# EAGLE design untitled (EAGLE 9.6.2)
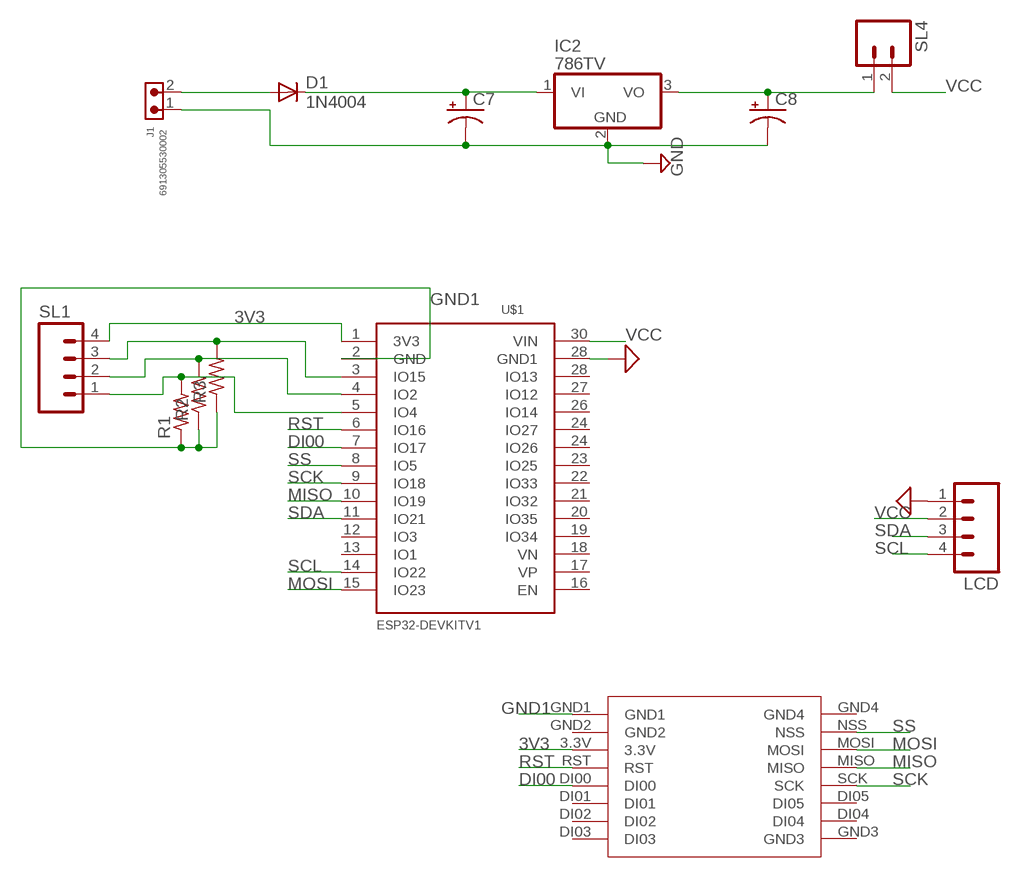
[diagram p0: schematic, sheet 1]

## Parts
C7  CAPACITOR-PE5-10.5  [E5-10,5]
C8  CAPACITOR-PE5-6  [E5-6]
D1  1N4004  [DO41-10]
IC2  786TV  [TO220V]
J1  691305530002  691305530002  [691305530002]
LCD  M04  [04P]
R1  R-US_0207/10  [0207/10]
R2  R-US_0207/10  [0207/10]
R3  R-US_0207/7  [0207/7]
SL1  M04  [04P]
SL4  M02  [02P]
U$1  ESP32DEVKITV1  [ESP32-DEVKITV1]
U$2  LORASX1278  [LORASX1278]

## Nets
3V3: SL1.4 U$1.1(3V3) U$2.3.3V
DI00: U$1.7(IO17) U$2.DI00
GND: C7.- C8.- IC2.2(GND) J1.1 LCD.1 U$1.28(GND1) ; supply symbol labelled SUP
GND1: R1.1 R2.1 R3.1 U$1.2(GND) U$2.GND1
MISO: U$1.10(IO19) U$2.MISO
MOSI: U$1.15(IO23) U$2.MOSI
N$1: D1.A J1.2
N$2: C8.+ IC2.3(VO) SL4.1
N$4: R1.2 SL1.1 U$1.5(IO4)
N$5: R2.2 SL1.2 U$1.4(IO2)
N$6: R3.2 SL1.3 U$1.3(IO15)
RST: U$1.6(IO16) U$2.RST
SCK: U$1.9(IO18) U$2.SCK
SCL: LCD.4 U$1.14(IO22)
SDA: LCD.3 U$1.11(IO21)
SS: U$1.8(IO5) U$2.NSS
VCC: LCD.2 SL4.2 U$1.30(VIN)
VIN: C7.+ D1.C IC2.1(VI)
Unconnected: U$1.12(IO3) U$1.13(IO1) U$1.16(EN) U$1.17(VP) U$1.18(VN) U$1.19(IO34) U$1.20(IO35) U$1.21(IO32) U$1.22(IO33) U$1.23(IO25) U$1.24(IO26) U$1.24(IO27) U$1.26(IO14) U$1.27(IO12) U$1.28(IO13) U$2.DI01 U$2.DI02 U$2.DI03 U$2.DI04 U$2.DI05 U$2.GND2 U$2.GND3 U$2.GND4

## Library data of the parts
C7 C8 = BeagleBone_Blue_R3:CAPACITOR-P: POLARIZED CAPACITOR, American symbol
D1 = adafruit:1N4004: DIODE General purpose 1N400x type rectifier (With bigger pads) http://www.ladyada.net/library/pcb/eaglelibrary.html
IC2 = linear:78*: Positive VOLTAGE REGULATOR Source: http://cache.national.com/ds/LM/LM78L05.pdf http://www.fairchildsemi.com/ds/LM/LM7805.pdf
J1 = Wurth_Connectors_WR-TBL Pluggable Connector:691305530002: WR-TBL Serie 3055 - 5,08 mm - PCB Header Vertical Entry with Plastic Latches KIND PROPERTIES Pitch 5.08 mm MATERIAL PROPERTIES Insulator Material PA66 Insulator Flammability Rating UL94 V-0 Insulator Color Green Terminal Material Copper Alloy Terminal Plating Tin-plated surface GENERAL INFORMATION Operating Temperature -40 up to +105 °C ELECTRICAL PROPERTIES IR UL 16 A Working Voltage [UL] 300 V (AC) Withstanding Voltage [UL] 2500 V (AC) Contact Resistance [UL] 20 mΩ CERTIFICATION UL Approval E315414 <https://www.we-online.com/catalog/media/o135349v209%20Family_WR-TBL3_6913055300xx.jpg> Details see: https://www.we-online.com/catalog/en/TBL_5_08_3055_6913055300XX/ Updated by Ella Wu 2019-12-30 2019(C) Wurth Elektronik; DATASHEET-URL: https://www.we-online.com/catalog/datasheet/691305530002.pdf; IR-UL: 16A; MOUNT: THT; PART-NUMBER: 691305530002; PINS: 2; PITCH: 5.08mm; TYPE: Vertical; WORKING-VOLTAGE-UL: 300V (AC)
LCD SL1 = con-amp-quick:M04: AMP QUICK CONNECTOR; OC_FARNELL: unknown; OC_NEWARK: unknown
R1-R3 = adafruit:R-US_: RESISTOR, American symbol
SL4 = con-amp-quick:M02: AMP QUICK CONNECTOR; OC_FARNELL: unknown; OC_NEWARK: unknown
U$1 = ESP32-DEVKITV1:ESP32DEVKITV1
U$2 = sx1278:LORASX1278

## Board
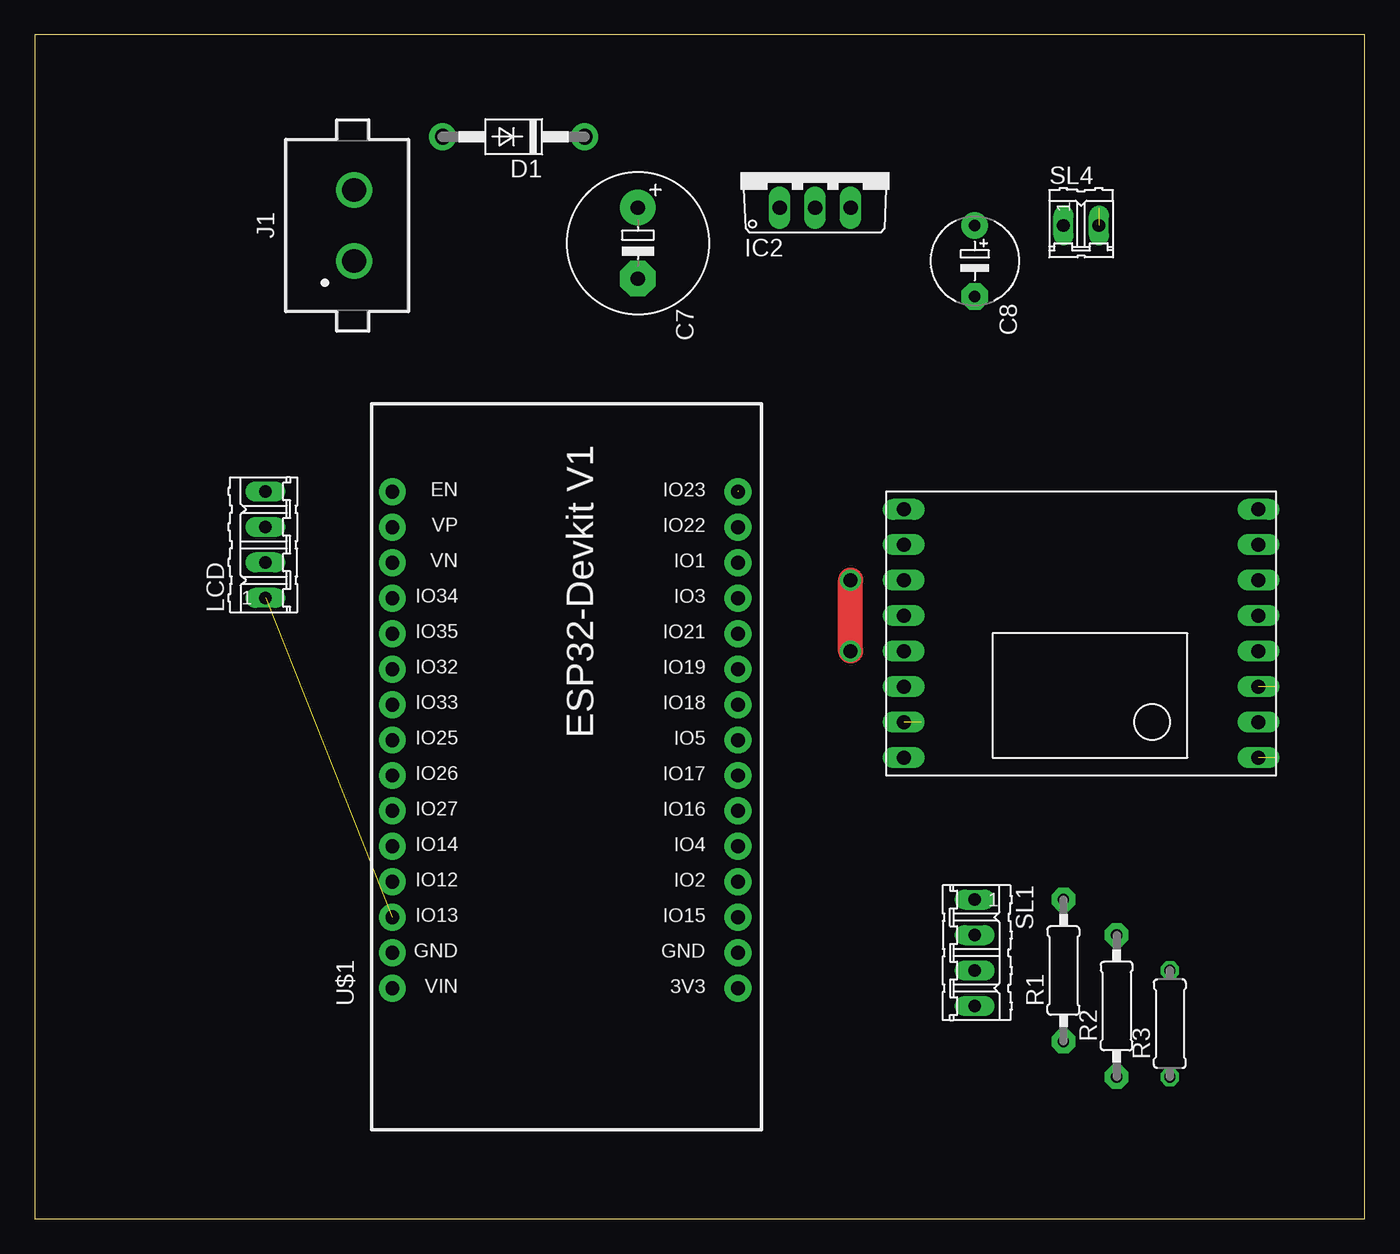
[diagram p1: board, top side]
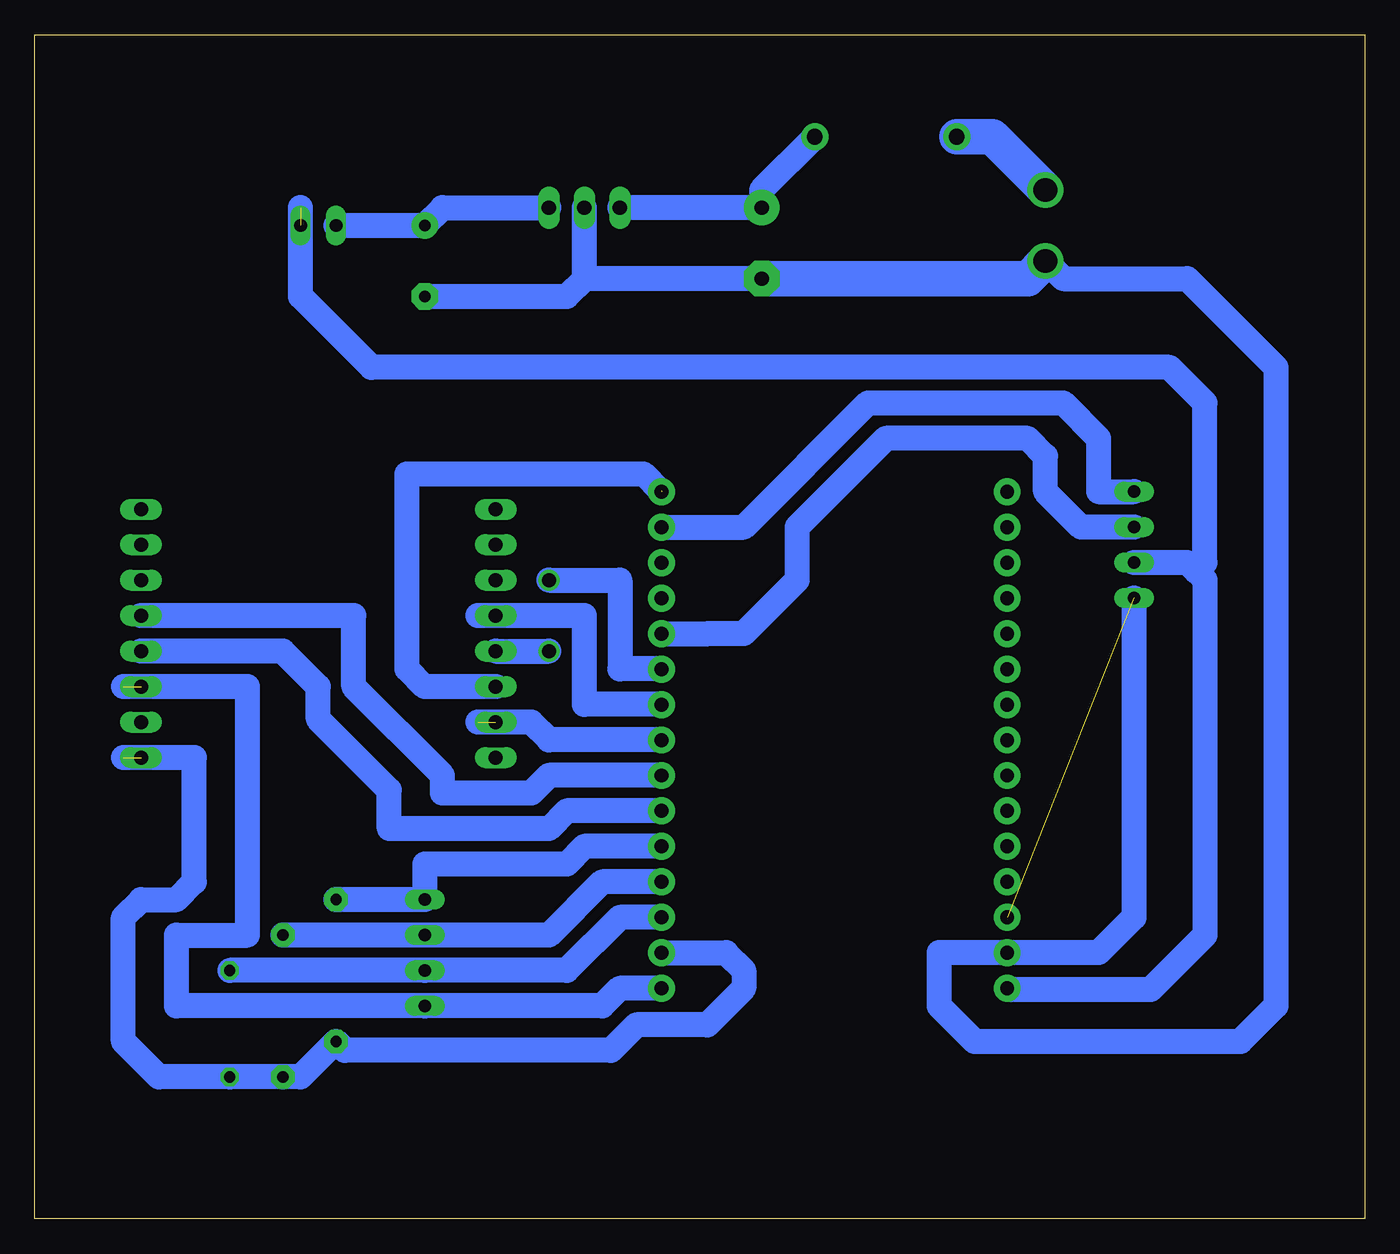
[diagram p2: board, bottom side, seen from below]

Size 95.23 x 84.76 mm. Coordinates in mm from the lower left corner, seen from the top.
Outline: 0,0 95.23,0 95.23,84.76 0,84.76 0,0
Copper layers (1*16): Top 0.035mm / dielectric 1.5mm / Bottom 0.035mm
Design rules "default *": minimum track width 6mil, minimum drill 0.35mm, track to track 30mil, track to pad 30mil, pad to pad 30mil, via to via 30mil, smd to smd 6mil, copper to edge 40mil, drill to drill 6mil, minimum pad ring 10mil, minimum via ring 8mil, stop-mask expansion 4mil, vias tented up to drill 0mil, thermal gap 10mil

### Footprints (pad centres in the part's own frame; a part is rotated, then mirrored left to right if it is on the bottom)
E5-10,5 = drill 1.016 pad 2.54: + -2.54,0 | drill 1.016 pad 2.54 octagon: - 2.54,0
E5-6 = drill 0.813 pad 1.905: + -2.54,0 | drill 0.813 pad 1.905 octagon: - 2.54,0
DO41-10 = drill 1.118 pad 1.93: A 5.08,0; C -5.08,0
TO220V = drill 1.016 long: 1 -2.54,-2.54; 2 0,-2.54; 3 2.54,-2.54
691305530002 = drill 1.7: 1 -2.54,0; 2 2.54,0
04P = drill 0.914 long: 1 -3.81,0; 2 -1.27,0; 3 1.27,0; 4 3.81,0
0207/10 = drill 0.813 pad 1.676 octagon: 1 -5.08,0; 2 5.08,0
0207/7 = drill 0.813 octagon: 1 -3.81,0; 2 3.81,0
02P = drill 0.914 long: 1 -1.27,0; 2 1.27,0
ESP32-DEVKITV1 = drill 1 pad 1.93: 1 -22.87,-13.54; 2 -20.33,-13.54; 3 -17.79,-13.54; 4 -15.25,-13.54; 5 -12.71,-13.54; 6 -10.17,-13.54; 7 -7.63,-13.54; 8 -5.09,-13.54; 9 -2.55,-13.54; 10 -0.01,-13.54; 11 2.53,-13.54; 12 5.07,-13.54; 13 7.61,-13.54; 14 10.15,-13.54; 15 12.69,-13.54; 16 12.69,11.23; 17 10.15,11.23; 18 7.61,11.23; 19 5.07,11.23; 20 2.53,11.23; 21 -0.01,11.23; 22 -2.55,11.23; 23 -5.09,11.23; 24 -7.63,11.23; 25 -10.17,11.23; 26 -12.71,11.23; 27 -15.25,11.23; 28 -17.79,11.23; 29 -20.33,11.23; 30 -22.87,11.23
LORASX1278 = drill 1 long: 3.3V -12.7,0; DI00 -12.7,-5.08; DI01 -12.7,-7.62; DI02 -12.7,-10.16; DI03 -12.7,-12.7; DI04 12.7,-10.16; DI05 12.7,-7.62; GND1 -12.7,5.08; GND2 -12.7,2.54; GND3 12.7,-12.7; GND4 12.7,5.08; MISO 12.7,-2.54; MOSI 12.7,0; NSS 12.7,2.54; RST -12.7,-2.54; SCK 12.7,-5.08

### Placement (x,y rotation side)
C7  43.18,69.85 270 top
C8  67.31,68.58 270 top
D1  34.29,77.47 180 top
IC2  55.88,74.93 0 top
J1  22.86,71.12 90 top
LCD  16.51,48.26 90 top
R1  73.66,17.78 90 top
R2  77.47,15.24 90 top
R3  81.28,13.97 90 top
SL1  67.31,19.05 270 top
SL4  74.93,71.12 0 top
U$1  36.83,39.37 90 top
U$2  74.93,38.1 180 top

### Tracks (layer width: path | path; a pad name or v marks a point on that pad's centre or on a via)
3V3  (1 unrouted)
  Bottom 1.778: U$1.1 53.35,16.5 54.61,15.24 SL1.4 85.09,15.24 85.09,20.32 80.01,20.32 80.01,38.1 88.9,38.1
DI00
  Bottom 1.778: U$1.7 58.42,31.75 59.69,30.48 66.04,30.48 66.04,31.75 72.39,38.1 72.39,43.18 U$2.DI00
GND  (1 unrouted)
  Bottom 1.778: C8.- 57.15,66.04 55.88,67.31 | 55.88,67.31 IC2.2 | C7.- 55.88,67.31 | LCD.1 16.51,21.59 19.05,19.05 30.48,19.05 30.48,15.24 27.94,12.7 8.89,12.7 6.35,15.24 6.35,60.96 12.7,67.31 21.59,67.31 J1.1
  Bottom 2.54: J1.1 24.13,67.31 C7.-
GND1  (1 unrouted)
  Bottom 1.778: U$1.2 45.73,19.04 45.72,19.05 44.45,17.78 44.45,16.51 47.08,13.88 52.16,13.88 53.98,12.06 73.03,12.06 R1.1 76.2,10.16 R2.1 R3.1 86.36,10.16 88.9,12.7 88.9,21.59 87.63,22.86 85.09,22.86 83.82,24.13 83.82,33.02 84.47,33.02 88.9,33.02
MISO  (via drill 1)
  Top 1.778: v58.42,40.64 v58.42,45.72
  Bottom 1.778: U$2.MISO v58.42,40.64 | v58.42,45.72 53.34,45.72 53.34,39.37 U$1.10
MOSI  (1 unrouted)
  Bottom 1.778: U$2.MOSI 67.31,38.1 68.58,39.37 68.58,53.34 51.65,53.34 50.45,52.14 50.37,52.14
N$1
  Bottom 2.54: J1.2 26.67,77.47 D1.A
N$2
  Bottom 1.778: SL4.1 C8.+ 66.04,72.39 IC2.3
N$4
  Bottom 1.778: U$1.5 55.89,26.66 57.15,25.4 67.31,25.4 SL1.1 R1.2
N$5
  Bottom 1.778: U$1.4 54.6,24.12 54.61,24.13 58.42,20.32 SL1.2 R2.2
N$6
  Bottom 1.778: U$1.3 53.33,21.58 53.34,21.59 57.15,17.78 SL1.3 R3.2
RST
  Bottom 1.778: U$1.6 57.15,29.21 58.42,27.94 69.85,27.94 69.85,30.7 74.93,35.78 74.93,38.1 77.47,40.64 U$2.RST
SCK
  Bottom 1.778: U$1.9 55.88,36.83 55.88,43.18 U$2.SCK 63.5,43.18
SCL
  Bottom 1.778: U$1.14 44.46,49.52 35.56,58.42 21.59,58.42 19.05,55.88 19.05,52.07 LCD.4
SDA
  Bottom 1.778: LCD.3 20.32,49.53 22.86,52.07 22.86,54.61 24.13,55.88 34.29,55.88 40.64,49.53 40.64,45.72 44.45,41.91 46.99,41.91 47,41.9 U$1.11
SS  (1 unrouted)
  Bottom 1.778: U$1.8 58.42,34.29 59.69,35.56 63.5,35.56
VCC  (1 unrouted)
  Bottom 1.778: LCD.2 12.7,46.99 12.06,46.36 | 12.06,46.36 11.43,45.72 11.43,20.32 15.33,16.42 25.6,16.42 U$1.30 | 12.06,46.36 11.43,46.99 11.43,58.42 13.97,60.96 71.12,60.96 76.2,66.04 76.2,72.39
VIN
  Bottom 1.778: IC2.1 C7.+ 43.18,73.66 D1.C